# Altium schematic sheet OSCILLAR_HFB_V1p0_AGSB.SchDoc
size A4; SheetNumber: 7; SheetTotal: 8; Title_: Aux Gain Stabilization Block
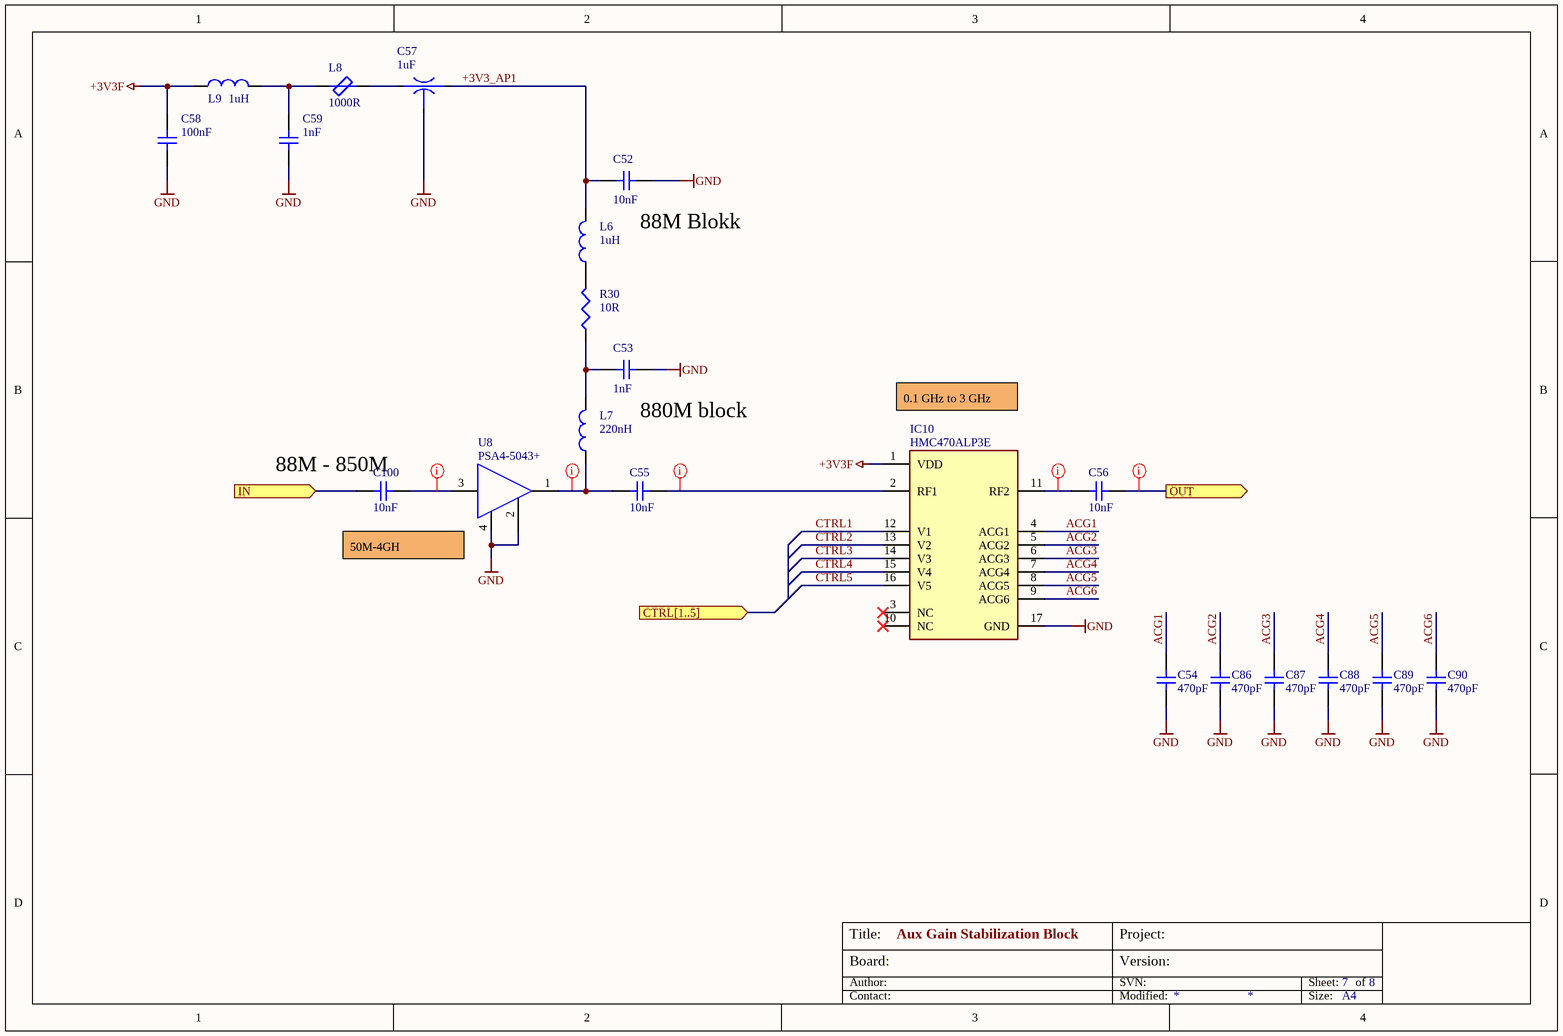
[diagram p0: OSCILLAR_HFB_V1p0_AGSB.SchDoc]

## Parts
C52  10nF  [CAP-0805]
C53  1nF  [CAP-0805]
C54  470pF  [CAP_0603]
C55  10nF  [CAP_0603]
C56  10nF  [CAP_0603]
C57  1uF  [CAP-0805-EMI]
C58  100nF  [CAP-0805]
C59  1nF  [CAP-0805]
C86  470pF  [CAP_0603]
C87  470pF  [CAP_0603]
C88  470pF  [CAP_0603]
C89  470pF  [CAP_0603]
C90  470pF  [CAP_0603]
C100  10nF  [CAP_0603]
IC10  HMC470ALP3E  [QFN-16]
L6  1uH  [IND-0805]
L7  220nH  [IND-0805]
L8  1000R  [IND-0805-EMI]
L9  1uH  [IND-0805-EMI]
R30  10R  [RES-0805]
U8  PSA4-5043+  [SOT-343-4]

## Ports
CTRL[1..5] (in), IN (in), OUT (out)

## Nets
+3V3F: C58.1 IC10.1(VDD) L9.1
GND: C52.2 C53.2 C54.2 C57.2 C58.2 C59.2 C86.2 C87.2 C88.2 C89.2 C90.2 IC10.17(GND) U8.2(GND) U8.4
+3V3_AP1: C52.1 C57.1 L6.2
ACG1: C54.1 IC10.4(ACG1)
ACG2: C86.1 IC10.5(ACG2)
ACG3: C87.1 IC10.6(ACG3)
ACG4: C88.1 IC10.7(ACG4)
ACG5: C89.1 IC10.8(ACG5)
ACG6: C90.1 IC10.9(ACG6)
CTRL1: IC10.12(V1)
CTRL2: IC10.13(V2)
CTRL3: IC10.14(V3)
CTRL4: IC10.15(V4)
CTRL5: IC10.16(V5)
IN: C100.2 ; port IN
OUT: C56.1 ; port OUT
NetC53_1: C53.1 L7.2 R30.1
NetC55_1: C55.1 IC10.2(RF1)
NetC55_2: C55.2 L7.1 U8.1(RF_OUT)
NetC56_2: C56.2 IC10.11(RF2)
NetC57_3: C57.3 L8.2
NetC59_1: C59.1 L8.1 L9.2
NetC100_1: C100.1 U8.3(RF_IN)
NetL6_1: L6.1 R30.2

Not connected (* = marked no-connect by the designer): IC10 3(NC)* 10(NC)*

## Layout directives
net class 50R: NetC55_1, NetC55_2, NetC56_2, NetC100_1, OUT

## Notes on the sheet
- (near C52) 88M Blokk
- (near C53) 880M block
- 0.1 GHz to 3 GHz
- (near C100) 88M - 850M
- 50M-4GH
- Board:
- Author:
- Title:
- Project:
- SVN:
- Version:
- Sheet:
- of
- Contact:
- Modified:
- Size:
- A4

## Library data of the parts
C52-C56 C58 C59 C86-C90 C100 = NP-CAPACITOR: MLCC capacitor; Type: CAP
C57 = EMI_CAPACITOR: EMI filter capacitor; Type: CAP
IC10 = HMC470ALP3E: Attenuators 0.1 GHz to 3 GHz,1 dB LSB, 5-Bit, GaAs Digital Attenuator; Part number: 584-HMC470ALP3E; Type: IC; Supplier: Mouser; ComponentLink1Description: Datasheet; ComponentLink1URL: hmc470A-3123262.pdf; ComponentLink2Description: Order; ComponentLink2URL: https://hu.mouser.com/ProductDetail/Analog-Devices/HMC470ALP3E?qs=AZz8fAaf6P9Q6OKTBvvI%252BA%3D%3D
L6 L7 L9 = AC-INDUCTOR: Air core coil; Type: IND
L8 = BLM21SP102SN1D: Chip Ferrite Bead, 1000R @100MHz, 1.6A; Part number: 81-BLM21SP102SN1D; Type: IND; Supplier: Mouser; ComponentLink1Description: Datasheet; ComponentLink1URL: ENFA0005-1915781.pdf; ComponentLink2Description: Order; ComponentLink2URL: https://hu.mouser.com/ProductDetail/Murata-Electronics/BLM21SP102SN1D?qs=17u8i%2FzlE88oj6hmj%252BXptA%3D%3D
R30 = RESISTOR: Metal Film Resistor; Type: RES
U8 = PSA4-5043+: RF Amplifier, Low noise, 50M-4GHz, +5V, +20dB; Part number: 139-PSA4-5043; ComponentLink1Description: Datasheet; ComponentLink1URL: PSA4_5043_2b-1700913.pdf; Supplier: Mouser; ComponentLink2Description: Order; ComponentLink2URL: https://hu.mouser.com/ProductDetail/Mini-Circuits/PSA4-5043%2b?qs=xZ%2FP%252Ba9zWqbLkryIxS%2FdVA%3D%3D; Type: IC